# Altium schematic sheet Sheet3.SchDoc
size A; SheetNumber: 1; SheetTotal: 1
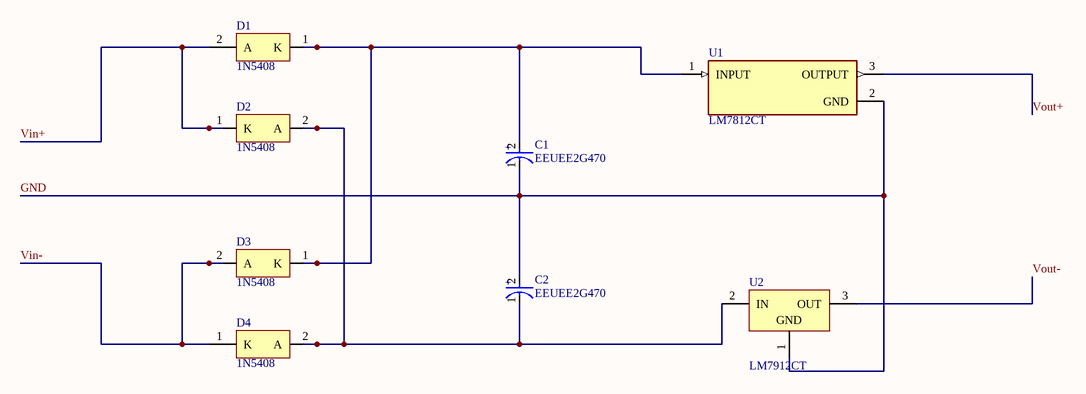
[diagram p0: Sheet3.SchDoc]

## Parts
C1  EEUEE2G470  [FP-RAD-TH-D_16_0_5-L_25_2-MFG]
C2  EEUEE2G470  [FP-RAD-TH-D_16_0_5-L_25_2-MFG]
D1  1N5408  [ONSC-AXIAL_LEAD-2-267-05_V]
D2  1N5408  [ONSC-AXIAL_LEAD-2-267-05_V]
D3  1N5408  [ONSC-AXIAL_LEAD-2-267-05_V]
D4  1N5408  [ONSC-AXIAL_LEAD-2-267-05_V]
U1  LM7812CT  [FP-TO220B03-MFG]
U2  LM7912CT  [NDE0003A]

## Nets
GND: C1.1(C) C2.2(A) U1.2(GND) U2.1(GND)
Vin+: D1.2(A) D2.1(K)
Vin-: D3.2(A) D4.1(K)
Vout+: U1.3(OUTPUT)
Vout-: U2.3(OUT)
NetC1_2: C1.2(A) D1.1(K) D3.1(K) U1.1(INPUT)
NetC2_1: C2.1(C) D2.2(A) D4.2(A) U2.2(IN)

## Notes on the sheet
- (in symbol CMP-05427-001116-1) +

## Library data of the parts
C1 C2 = CMP-05427-001116-1: Aluminum Electrolytic Capacitors (Radial Lead Type) 47uF ±20% 400V; Ripple Current (AC): 1.18A; Dissipation Factor: 0.24%; Dielectric Material: Aluminium; Life (Hours): 10000Hour; Lead Diameter: 0.8mm; Leakage Current: 1.138mA; Mount: Through Hole; Diameter: 16mm; Number of Pins: 2; Capacitance: 47uF; Package Quantity: 100; Voltage: 400V; Voltage Rating (DC): 400V; Max Operating Temperature: 105°C; Termination: Radial; Case/Package: Radial; Lead Free: Lead Free; Construction: RADIAL; Lead Pitch: 7.5mm; Series: EE; Tolerance: 20%; Length: 25mm; RoHS Compliant: Yes; Ripple Current: 1.18A; Height - Seated (Max): 0.984inch; Radiation Hardening: No; Height: 25mm; Voltage Rating: 400V; Packaging: Bulk; Min Operating Temperature: -25°C; REACH SVHC: No SVHC
D1-D4 = CMP-0902-00037-1: Standard Recovery Rectifier, 2-Pin Axial_Lead, Pb-Free, Bulk Box; Manufacturer: On Semiconductor; IFSM Max (A): 200; IO(rec) Max (A): 3; VRRM Max (V): 1000; RoHS: TRUE; ComponentLink3URL: http://www.onsemi.com/pub_link/Collateral/267-05.PDF; ComponentLink2URL: http://www.onsemi.com/pub_link/Collateral/1N5400-D.PDF; ComponentLink3Description: Package Specification; Mounting Technology: Through Hole; PartNumber: 1N5408; Type: Standard Recovery; PackageDescription: 2-Pin, Axial Lead, Diameter 5.05 mm; Packing: Bulk Box; PackageReference: AXIAL_LEAD-2-267-05; ComponentLink2Description: Datasheet; DatasheetVersion: Rev. 10; ComponentLink1Description: Manufacturer URL; PackageVersion: Rev. G, 06/2000; ComponentLink1URL: http://www.onsemi.com/
U1 = CMP-07128-000015-1: IC REG LINEAR 12V 1A TO220-3; Obsolete Part: true; Manufacturer: ON Semiconductor; Nominal Supply Current: 5.1mA; Output Type: Fixed; Dropout Voltage: 2V; Max Supply Voltage: 35V; Accuracy Percentage: 4%; Standoff Height: 2.7mm; Number Of Outputs: 1; Octopart: https://octopart.com/lm7812ct-on+semiconductor-14383031; Output Current: 1A; ComponentLink2Description: Datasheet; Device Class L1: Integrated Circuits (ICs); Device Class L2: Power Management ICs; Temperature Range Low: -40°C; Category: IC; Package: TO220B03; Device Class L3: Voltage Regulators - Linear; RoHS: TRUE; Digikey Description: IC REG LINEAR 12V 1A TO220-3; Ipc Land Pattern Name: TO-220; Output Voltage: 12V; Temperature: -40°C to +125°C; Automotive: No; Temperature Range High: +125°C; ComponentLink2URL: https://www.mouser.in/datasheet/2/308/LM7812-1125088.pdf; Manufacturer Part Number: LM7812CT; Height: 20.4mm; Lead Free: Yes
U2 = CMP-0062-02472-3: 3-Terminal Negative Regulator, 3-pin TO-220; Manufacturer: Texas Instruments; CompType: LDO IC; PowerWise: N; PackageTopMarking: NSUZXYTTE#*LM7912CT; PinCount: 3; RoHS: N; PackageDescription: TO-220, Molded, 3 Lead, Straight; ComponentLink1URL: http://www.ti.com/general/docs/lit/getliterature.tsp?genericPartNumber=LM7912&fileType=pdf; PackageReference: NDE0003A; ComponentLink1Description: Datasheet URL